# EAGLE design v7-flex2811_4x (EAGLE 7.3.0)

## Sheet 1 of 4
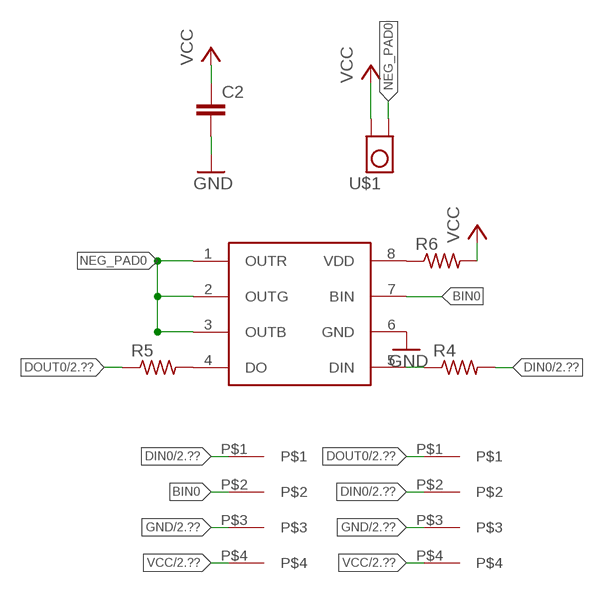
[diagram p0: schematic, sheet 1]

### Parts
C2  C-EUC0201  [C0201]
R4  R-US_R0201  [R0201]
R5  R-US_R0201  [R0201]
R6  R-US_R0201  [R0201]
U$1  TP_4MM_MED_PAD  [TP_4MM_MED_PAD]
U$2  WS2818  [SO08]
U$3  4PAD  [4PAD]
U$4  4PAD  [4PAD]

### Nets
BIN0: U$2.7(BIN) U$3.P$2
DIN0: R4.2 U$3.P$1 U$4.P$2 ; also sheet 2
DOUT0: R5.1 U$4.P$1 ; also sheet 2,3
GND: C2.2 U$2.6(GND) U$3.P$3 U$4.P$3 ; also sheet 2,3,4
N$4: R4.1 U$2.5(DIN)
N$5: R5.2 U$2.4(DO)
N$6: R6.1 U$2.8(VDD)
NEG_PAD0: U$1.P$1 U$2.1(OUTR) U$2.2(OUTG) U$2.3(OUTB)
VCC: C2.1 R6.2 U$1.P$2 U$3.P$4 U$4.P$4 ; also sheet 2,3,4

## Sheet 2 of 4
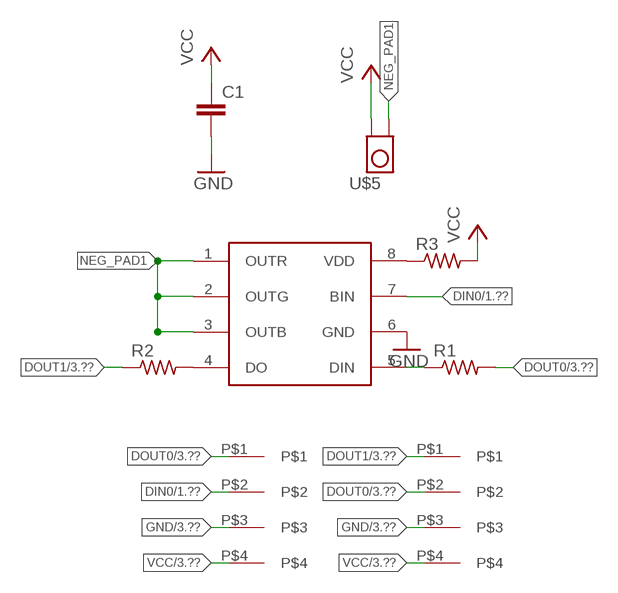
[diagram p1: schematic, sheet 2]

### Parts
C1  C-EUC0201  [C0201]
R1  R-US_R0201  [R0201]
R2  R-US_R0201  [R0201]
R3  R-US_R0201  [R0201]
U$5  TP_4MM_MED_PAD  [TP_4MM_MED_PAD]
U$6  WS2818  [SO08]
U$7  4PAD  [4PAD]
U$8  4PAD  [4PAD]

### Nets
DIN0: U$6.7(BIN) U$7.P$2 ; also sheet 1
DOUT0: R1.2 U$7.P$1 U$8.P$2 ; also sheet 1,3
DOUT1: R2.1 U$8.P$1 ; also sheet 3,4
GND: C1.2 U$6.6(GND) U$7.P$3 U$8.P$3 ; also sheet 1,3,4
N$1: R1.1 U$6.5(DIN)
N$2: R2.2 U$6.4(DO)
N$3: R3.1 U$6.8(VDD)
NEG_PAD1: U$5.P$1 U$6.1(OUTR) U$6.2(OUTG) U$6.3(OUTB)
VCC: C1.1 R3.2 U$5.P$2 U$7.P$4 U$8.P$4 ; also sheet 1,3,4

## Sheet 3 of 4
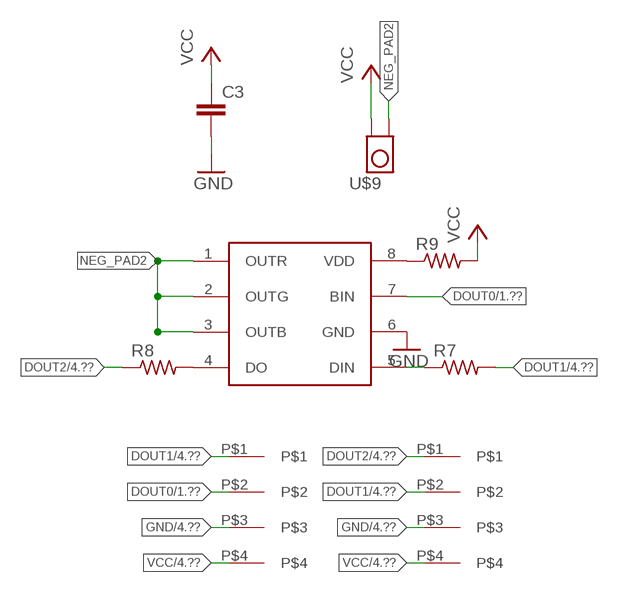
[diagram p2: schematic, sheet 3]

### Parts
C3  C-EUC0201  [C0201]
R7  R-US_R0201  [R0201]
R8  R-US_R0201  [R0201]
R9  R-US_R0201  [R0201]
U$9  TP_4MM_MED_PAD  [TP_4MM_MED_PAD]
U$10  WS2818  [SO08]
U$11  4PAD  [4PAD]
U$12  4PAD  [4PAD]

### Nets
DOUT0: U$10.7(BIN) U$11.P$2 ; also sheet 1,2
DOUT1: R7.2 U$11.P$1 U$12.P$2 ; also sheet 2,4
DOUT2: R8.1 U$12.P$1 ; also sheet 4
GND: C3.2 U$10.6(GND) U$11.P$3 U$12.P$3 ; also sheet 1,2,4
N$7: R7.1 U$10.5(DIN)
N$8: R8.2 U$10.4(DO)
N$9: R9.1 U$10.8(VDD)
NEG_PAD2: U$9.P$1 U$10.1(OUTR) U$10.2(OUTG) U$10.3(OUTB)
VCC: C3.1 R9.2 U$9.P$2 U$11.P$4 U$12.P$4 ; also sheet 1,2,4

## Sheet 4 of 4
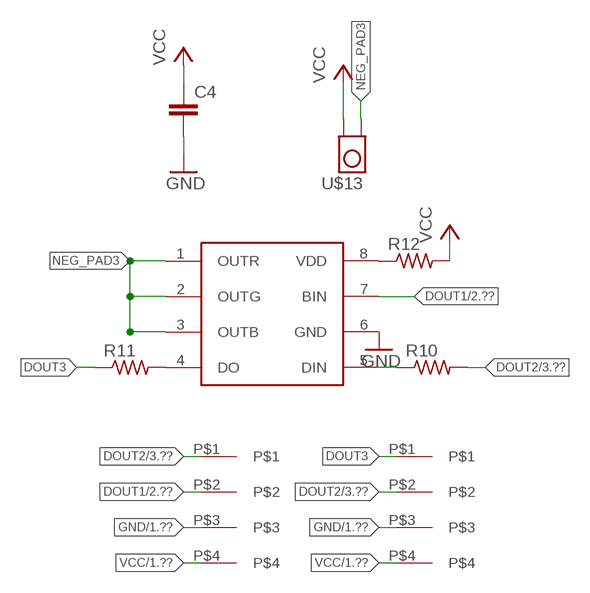
[diagram p3: schematic, sheet 4]

### Parts
C4  C-EUC0201  [C0201]
R10  R-US_R0201  [R0201]
R11  R-US_R0201  [R0201]
R12  R-US_R0201  [R0201]
U$13  TP_4MM_MED_PAD  [TP_4MM_MED_PAD]
U$14  WS2818  [SO08]
U$15  4PAD  [4PAD]
U$16  4PAD  [4PAD]

### Nets
DOUT1: U$14.7(BIN) U$15.P$2 ; also sheet 2,3
DOUT2: R10.2 U$15.P$1 U$16.P$2 ; also sheet 3
DOUT3: R11.1 U$16.P$1
GND: C4.2 U$14.6(GND) U$15.P$3 U$16.P$3 ; also sheet 1,2,3
N$10: R10.1 U$14.5(DIN)
N$11: R11.2 U$14.4(DO)
N$12: R12.1 U$14.8(VDD)
NEG_PAD3: U$13.P$1 U$14.1(OUTR) U$14.2(OUTG) U$14.3(OUTB)
VCC: C4.1 R12.2 U$13.P$2 U$15.P$4 U$16.P$4 ; also sheet 1,2,3

## Library data of the parts
C1-C4 = rcl:C-EU: CAPACITOR, European symbol
R1-R12 = rcl:R-US_: RESISTOR, American symbol
U$1 U$5 U$9 U$13 = tom-tappytap-v5-flex:TP_4MM_MED_PAD
U$2 U$6 U$10 U$14 = Sparky:WS2818
U$3 U$4 U$7 U$8 U$11 U$12 U$15 U$16 = Sparky:4PAD

## Board
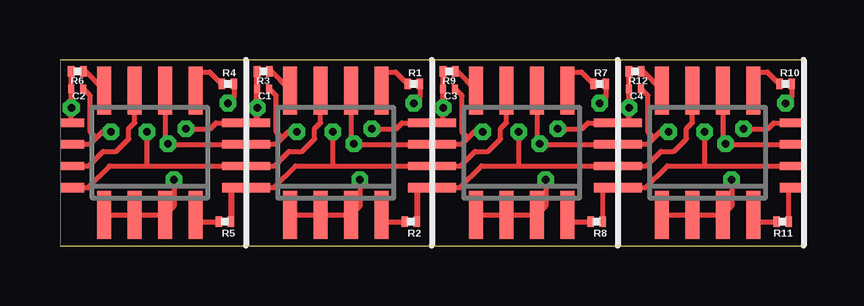
[diagram p4: board, top side]
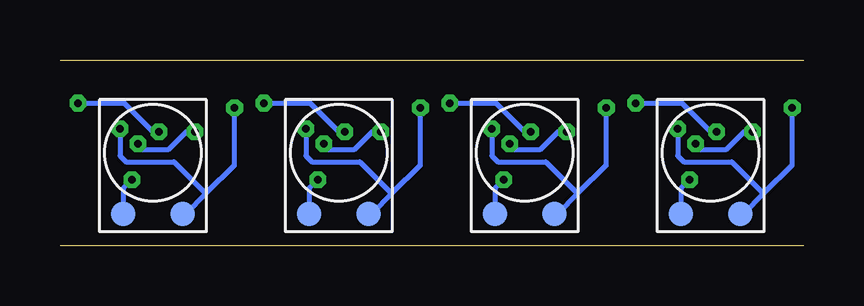
[diagram p5: board, bottom side, seen from below]

Size 31 x 7.75 mm. Coordinates in mm from the lower left corner, seen from the top.
Outline: 0,0 31,0
Outline: 31,7.75 0,7.75
Copper layers (1*16): Top 0.035mm / dielectric 1.5mm / Bottom 0.035mm
Design rules "default": minimum track width 10mil, minimum drill 24mil, track to track 8mil, track to pad 8mil, pad to pad 8mil, via to via 8mil, smd to smd 8mil, copper to edge 40mil, drill to drill 8mil, minimum pad ring 10mil, minimum via ring 8mil, stop-mask expansion 4mil, vias tented up to drill 0mil, thermal gap 10mil

### Footprints (pad centres in the part's own frame; a part is rotated, then mirrored left to right if it is on the bottom)
C0201 = smd 0.25 x 0.35: 1 -0.25,0; 2 0.25,0
R0201 = smd 0.28 x 0.43: 1 -0.255,0; 2 0.255,0
TP_4MM_MED_PAD = smd 1.016 x 1.016: P$1 -1.24,-2.55; P$2 1.24,-2.55
SO08 = smd 0.6 x 2: 1 -1.905,-2.6; 2 -0.635,-2.6; 3 0.635,-2.6; 4 1.905,-2.6; 5 1.905,2.6; 6 0.635,2.6; 7 -0.635,2.6; 8 -1.905,2.6
4PAD = smd 1 x 0.4: P$1 0,0.3 | smd 1 x 0.35: P$2 0,1.2; P$3 0,2.1; P$4 0,3

### Placement (x,y rotation side)
C1  8.47,6.55 0 top
C2  0.72,6.55 0 top
C3  16.23,6.55 0 top
C4  23.98,6.55 0 top
R1  14.75,6.75 0 top
R2  14.62,1 180 top
R3  8.47,7.28 180 top
R4  7,6.75 0 top
R5  6.88,1 180 top
R6  0.72,7.28 180 top
R7  22.5,6.75 0 top
R8  22.38,1 180 top
R9  16.23,7.28 180 top
R10  30.25,6.75 0 top
R11  30.12,1 180 top
R12  23.98,7.28 180 top
U$1  3.88,3.88 0 bottom
U$2  3.75,3.88 0 top
U$3  0.5,2.12 0 top
U$4  7.25,2.12 0 top
U$5  11.62,3.88 0 bottom
U$6  11.5,3.88 0 top
U$7  8.25,2.12 0 top
U$8  15,2.12 0 top
U$9  19.38,3.88 0 bottom
U$10  19.25,3.88 0 top
U$11  16,2.12 0 top
U$12  22.75,2.12 0 top
U$13  27.12,3.88 0 bottom
U$14  27,3.88 0 top
U$15  23.75,2.12 0 top
U$16  30.5,2.12 0 top

### Tracks (layer width: path | path; a pad name or v marks a point on that pad's centre or on a via)
BIN0
  Top 0.2: U$3.P$2 1.2,3.33 1.8,3.93 2.35,3.93 2.87,4.45 2.87,4.89 3.12,5.13 U$2.7
DIN0  (via drill 0.3)
  Top 0.2: 3.62,3.33 v3.62,4.75 | R4.2 7.25,6.2 v7,5.94 | U$3.P$1 1.17,2.42 2.06,3.33 3.62,3.33 | 3.62,3.33 U$4.P$2 | U$7.P$2 8.95,3.33 9.55,3.93 10.1,3.93 10.62,4.45 10.62,4.89 10.87,5.13 U$6.7
  Top 0.254: U$7.P$2 U$4.P$2
  Bottom 0.2: v3.62,4.75 3.88,4.75 5.07,5.94 v7,5.94
DOUT0  (via drill 0.3)
  Top 0.2: R5.1 7.13,2.31 U$4.P$1 | 11.38,3.33 v11.38,4.75 | R1.2 15.01,6.2 v14.75,5.94 | U$7.P$1 8.91,2.42 9.81,3.33 11.38,3.33 | 11.38,3.33 U$8.P$2 | U$11.P$2 16.7,3.33 17.3,3.93 17.85,3.93 18.37,4.45 18.37,4.89 18.61,5.13 U$10.7 18.62,6.46
  Top 0.254: U$7.P$1 7.13,2.42 R5.1 | U$11.P$2 U$8.P$2
  Bottom 0.2: v11.38,4.75 11.62,4.75 12.81,5.94 v14.75,5.94
DOUT1  (via drill 0.3)
  Top 0.2: R2.1 14.88,2.31 U$8.P$1 | 19.12,3.33 v19.12,4.75 | R7.2 22.75,6.2 v22.5,5.94 | U$11.P$1 16.66,2.42 17.57,3.33 19.12,3.33 | 19.12,3.33 U$12.P$2 | U$15.P$2 24.45,3.33 25.05,3.93 25.6,3.93 26.12,4.45 26.12,4.89 26.36,5.13 U$14.7 26.38,6.46
  Top 0.254: U$11.P$1 14.88,2.42 R2.1 | U$15.P$2 U$12.P$2
  Bottom 0.2: v19.12,4.75 19.38,4.75 20.57,5.94 v22.5,5.94
DOUT2  (via drill 0.3)
  Top 0.2: R8.1 22.63,2.31 U$12.P$1 | 26.88,3.33 v26.88,4.75 | R10.2 30.5,6.2 v30.25,5.94 | U$15.P$1 24.41,2.42 25.32,3.33 26.88,3.33 | 26.88,3.33 U$16.P$2
  Top 0.254: U$12.P$1 U$15.P$1
  Bottom 0.2: v26.88,4.75 27.12,4.75 28.32,5.94 v30.25,5.94
DOUT3
  Top 0.2: R11.1 30.38,2.31 U$16.P$1
GND  (via drill 0.3)
  Top 0.2: U$2.6 4.38,4.37 v4.5,4.25 4.53,4.22 U$4.P$3 7.22,4.25 | U$3.P$3 0.85,4.22 0.88,4.25 1.25,4.25 1.5,4.5 | 1.5,4.5 1.75,4.75 v2.12,4.75 | 1.5,4.5 1.27,4.73 1.27,6.25 C2.2 | U$6.6 12.13,4.37 v12.25,4.25 12.28,4.22 U$8.P$3 14.97,4.25 | U$7.P$3 8.6,4.22 8.62,4.25 9,4.25 9.25,4.5 | 9.25,4.5 9.5,4.75 v9.88,4.75 | 9.25,4.5 9.02,4.73 9.02,6.25 C1.2 | U$10.6 19.89,4.37 v20,4.25 20.02,4.22 U$12.P$3 22.73,4.25 | U$11.P$3 16.35,4.22 16.38,4.25 16.75,4.25 17,4.5 | 17,4.5 17.25,4.75 v17.62,4.75 | 17,4.5 16.77,4.73 16.77,6.25 C3.2 | U$14.6 27.64,4.37 v27.75,4.25 27.77,4.22 U$16.P$3 30.48,4.25 | U$15.P$3 24.1,4.22 24.12,4.25 24.5,4.25 24.75,4.5 | 24.75,4.5 25,4.75 v25.38,4.75 | 24.75,4.5 24.52,4.73 24.52,6.25 C4.2
  Top 0.254: U$7.P$3 U$4.P$3 | U$11.P$3 U$8.P$3 | U$15.P$3 U$12.P$3
  Bottom 0.2: v4.5,4.25 4.5,4 3.25,4 2.5,4.75 v2.12,4.75 | v12.25,4.25 12.25,4 11,4 10.25,4.75 v9.88,4.75 | v20,4.25 20,4 18.75,4 18,4.75 v17.62,4.75 | v27.75,4.25 27.75,4 26.5,4 25.75,4.75 v25.38,4.75
N$1
  Top 0.2: 13.4,6.78 U$6.5 13.38,6.5 13.38,7 13.62,7.25 13.99,7.25 R1.1
N$2
  Top 0.2: U$6.4 13.68,1 R2.2
N$3
  Top 0.2: 9.6,6.78 U$6.8 8.79,7.28 R3.1
N$4
  Top 0.2: 5.66,6.78 U$2.5 5.62,6.5 5.62,7 5.88,7.25 6.25,7.25 R4.1
N$5
  Top 0.2: U$2.4 5.93,1 R5.2
N$6
  Top 0.2: 1.84,6.78 U$2.8 1.04,7.28 R6.1
N$7
  Top 0.2: 21.16,6.78 U$10.5 21.12,6.5 21.12,7 21.38,7.25 21.75,7.25 R7.1
N$8
  Top 0.2: U$10.4 21.43,1 R8.2
N$9
  Top 0.2: 17.34,6.78 U$10.8 16.55,7.28 R9.1
N$10
  Top 0.2: 28.91,6.78 U$14.5 28.88,6.5 28.88,7 29.12,7.25 29.5,7.25 R10.1
N$11
  Top 0.2: U$14.4 29.18,1 R11.2
N$12
  Top 0.2: 25.09,6.78 U$14.8 24.3,7.28 R12.1
NEG_PAD0  (via drill 0.3)
  Top 0.2: U$2.1 U$2.2 U$2.3 4.75,1.64 v4.75,2.75
  Bottom 0.2: v4.75,2.75 5.12,2.38 U$1.P$1
NEG_PAD1  (via drill 0.3)
  Top 0.2: U$6.1 U$6.2 U$6.3 12.5,1.64 v12.5,2.75
  Bottom 0.2: v12.5,2.75 12.87,2.38 U$5.P$1
NEG_PAD2  (via drill 0.3)
  Top 0.2: U$10.1 U$10.2 U$10.3 20.25,1.64 v20.25,2.75
  Bottom 0.2: v20.25,2.75 20.61,2.38 U$9.P$1
NEG_PAD3  (via drill 0.3)
  Top 0.2: U$14.1 U$14.2 U$14.3 28,1.64 v28,2.75
  Bottom 0.2: v28,2.75 28.36,2.38 U$13.P$1
VCC  (via drill 0.3)
  Top 0.2: v5.25,4.88 6.25,4.88 6.5,5.12 U$4.P$4 | U$3.P$4 0.47,5.15 v0.47,5.75 C2.1 0.47,6.66 R6.2 | v13,4.88 14,4.88 14.25,5.12 U$8.P$4 | U$7.P$4 8.22,5.15 v8.22,5.75 C1.1 8.22,6.66 R3.2 | v20.75,4.88 21.75,4.88 22,5.12 U$12.P$4 | U$11.P$4 15.97,5.15 v15.97,5.75 C3.1 15.97,6.66 R9.2 | v28.5,4.88 29.5,4.88 29.75,5.12 U$16.P$4 | U$15.P$4 23.73,5.15 v23.73,5.75 C4.1 23.72,6.66 R12.2
  Top 0.254: U$4.P$4 8.22,5.12 R3.2 | 15.97,5.15 15,5.15 U$8.P$4 | 23.73,5.15 22.77,5.15 U$12.P$4
  Bottom 0.2: v5.25,4.88 5.25,3.75 5,3.5 3,3.5 1.67,2.17 | v0.47,5.75 0.47,3.36 1.67,2.17 | 1.67,2.17 2.51,1.32 U$1.P$2 | v13,4.88 13,3.75 12.75,3.5 10.75,3.5 9.42,2.17 | v8.22,5.75 8.22,3.36 9.42,2.17 | 9.42,2.17 10.26,1.32 U$5.P$2 | v20.75,4.88 20.75,3.75 20.5,3.5 18.5,3.5 17.17,2.17 | v15.97,5.75 15.97,3.36 17.17,2.17 | 17.17,2.17 18.01,1.32 U$9.P$2 | v28.5,4.88 28.5,3.75 28.25,3.5 26.25,3.5 24.92,2.17 | v23.73,5.75 23.73,3.36 24.92,2.17 | 24.92,2.17 25.76,1.32 U$13.P$2